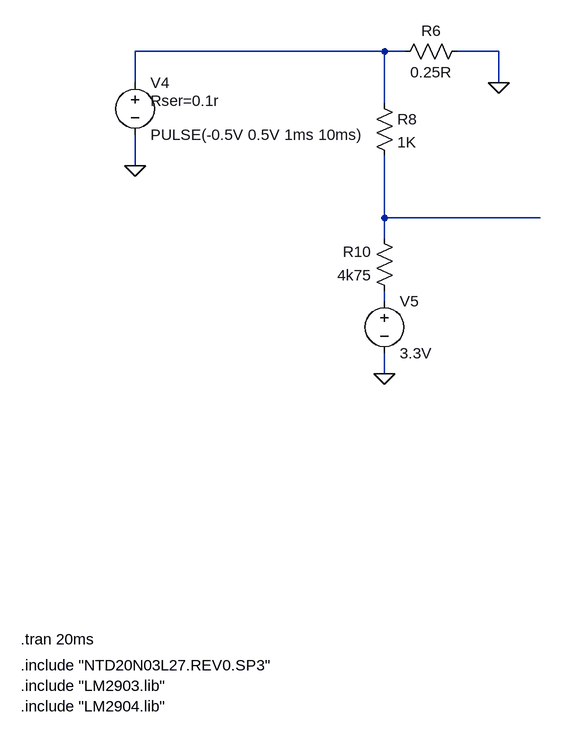
[diagram p0: schematic current sense -1.asc]
current sense -1.asc, the LTspice schematic file:
Version 4
SHEET 1 2500 836
WIRE 1520 -544 1136 -544
WIRE 1552 -544 1520 -544
WIRE 1696 -544 1632 -544
WIRE 1136 -496 1136 -544
WIRE 1696 -496 1696 -544
WIRE 1520 -464 1520 -544
WIRE 1136 -368 1136 -416
WIRE 1520 -288 1520 -384
WIRE 1760 -288 1520 -288
WIRE 1520 -256 1520 -288
WIRE 1520 -160 1520 -176
WIRE 1520 -48 1520 -80
FLAG 1136 -368 0
FLAG 1520 -48 0
FLAG 1696 -496 0
SYMBOL res 1648 -560 R90
WINDOW 0 0 56 VBottom 2
WINDOW 3 32 56 VTop 2
SYMATTR InstName R6
SYMATTR Value 0.25R
SYMBOL res 1504 -480 R0
SYMATTR InstName R8
SYMATTR Value 1K
SYMBOL res 1536 -160 R180
WINDOW 0 36 76 Left 2
WINDOW 3 36 40 Left 2
SYMATTR InstName R10
SYMATTR Value 4k75
SYMBOL voltage 1520 -176 R0
WINDOW 123 0 0 Left 2
WINDOW 39 0 0 Left 2
SYMATTR InstName V5
SYMATTR Value 3.3V
SYMBOL voltage 1136 -512 R0
WINDOW 123 0 0 Left 2
WINDOW 39 24 44 Left 2
SYMATTR SpiceLine Rser=0.1r
SYMATTR InstName V4
SYMATTR Value PULSE(-0.5V 0.5V 1ms 10ms)
TEXT 960 400 Left 2 !.include "NTD20N03L27.REV0.SP3"
TEXT 960 432 Left 2 !.include "LM2903.lib"\n.include "LM2904.lib"
TEXT 960 360 Left 2 !.tran 20ms

The netlist it stands for:
* current sense -1.asc
R6 0 N001 0.25R
R8 N001 N002 1K
R10 N003 N002 4k75
V5 N003 0 3.3V
V4 N001 0 PULSE(-0.5V 0.5V 1ms 10ms) Rser=0.1r
.include "NTD20N03L27.REV0.SP3"
.include "LM2903.lib"
.include "LM2904.lib"
.tran 20ms
.backanno
.end